# Altium schematic sheet I2C_ADC.SchDoc: Circuit ADC I2C
size Letter; ApprovedBy: Kevin Cotton; Author: Ing. Di Stefano; Organization: Cegep Limoilou; Address1: 1300, 8e Avenue; Address2: Québec, QC; Address3: Canada; Address4: G1J 5L5; Revision: A; SheetNumber: 2; SheetTotal: 3
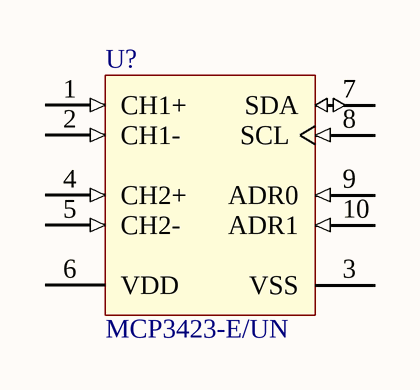
[diagram p0: I2C_ADC.SchDoc]

## Parts
U?  MCP3423-E/UN  [U_MSOP50P300X500-10(RM-10)_WO-TP]

## Nets

Not connected (* = marked no-connect by the designer): U? 1(CH1+) 2(CH1-) 3(VSS) 4(CH2+) 5(CH2-) 6(VDD) 7(SDA) 8(SCL) 9(ADR0) 10(ADR1)

## Notes on the sheet
- Titre :
- Conception :
- Date :
- Approbation :
- Heure :
- Révision :
- Feuille
- de
- Fichier :

## Library data of the parts
U? = U_MCP3423-E/UN: CAN Controller Stand-Alone With SPI, 18-Pin PDIP; Manufacturer 1: Microchip; Manufacturer Part Number 1: MCP3423-E/UN; Supplier 1: LCSC; Supplier Part Number 1: C220864; Mounting Technology: SMT; Supplier 2: Digikey; Supplier Part Number 2: MCP3423-E/UN-ND